# Altium schematic sheet Top.SchDoc
size A
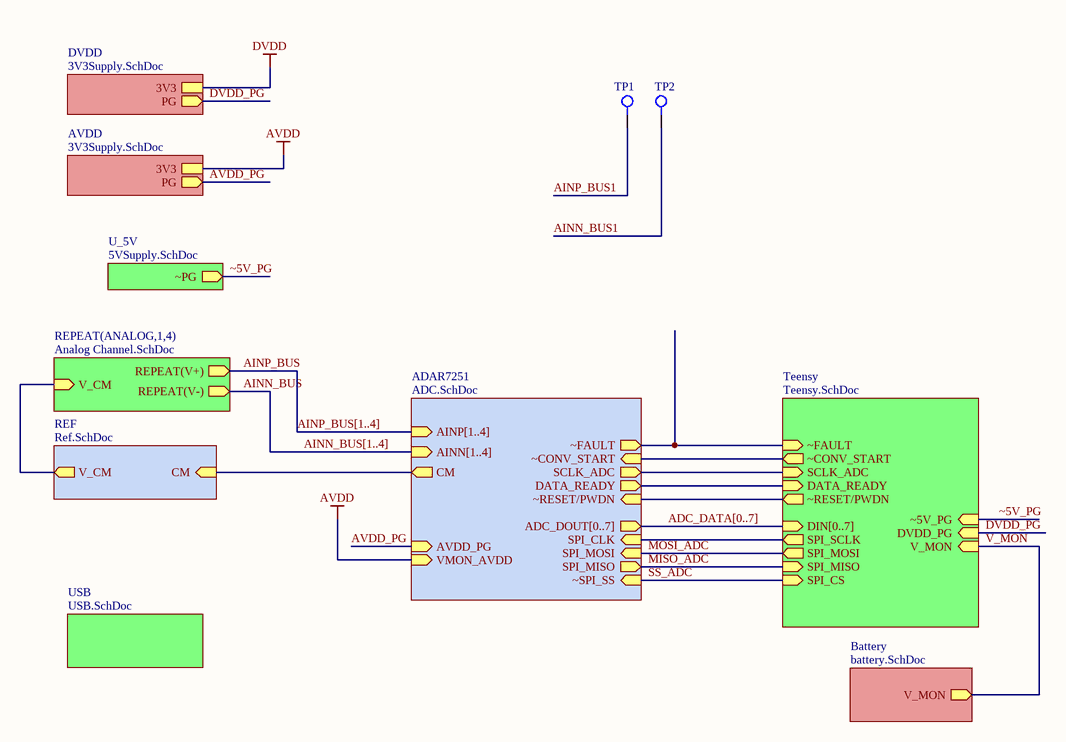
[diagram p0: Top.SchDoc]

## Parts
TP1  TP  [TP_5029]  (value not drawn)
TP2  TP  [TP_5029]  (value not drawn)

## Sub-sheets
ADAR7251 = ADC.SchDoc: AINP[1..4] (in), AINN[1..4] (in), CM (out), ADC_DOUT[0..7] (out), ~CONV_START (in), SCLK_ADC (out), ~SPI_SS (in), SPI_MISO (out), ~FAULT (out), DATA_READY (out), SPI_CLK (in), SPI_MOSI (in), ~RESET/PWDN (in), AVDD_PG (in), VMON_AVDD (in)
AVDD = 3V3Supply.SchDoc: 3V3, PG (out)
Battery = battery.SchDoc: V_MON (out)
DVDD = 3V3Supply.SchDoc: 3V3, PG (out)
REF = Ref.SchDoc: CM (in), V_CM (out)
REPEAT(ANALOG,1,4) = Analog Channel.SchDoc: REPEAT(V+) (out), REPEAT(V-) (out), V_CM (in)
Teensy = Teensy.SchDoc: SPI_MISO (in), ~FAULT (in), SCLK_ADC (in), DVDD_PG (in), ~CONV_START (out), DATA_READY (in), SPI_SCLK (out), SPI_MOSI (out), SPI_CS (in), DIN[0..7] (in), ~RESET/PWDN (out), V_MON (in), ~5V_PG (in)
U_5V = 5VSupply.SchDoc: ~PG (out)
USB = USB.SchDoc: no entries

## Nets
AVDD: sheet ADAR7251/VMON_AVDD, sheet AVDD/3V3
DVDD: sheet DVDD/3V3
AINN_BUS: sheet REPEAT(ANALOG,1,4)/REPEAT(V-)
AINN_BUS1: TP2.1
AINP_BUS: sheet REPEAT(ANALOG,1,4)/REPEAT(V+)
AINP_BUS1: TP1.1
AVDD_PG: sheet ADAR7251/AVDD_PG, sheet AVDD/PG
DVDD_PG: sheet DVDD/PG, sheet Teensy/DVDD_PG
MISO_ADC: sheet ADAR7251/SPI_MISO, sheet Teensy/SPI_MISO
MOSI_ADC: sheet ADAR7251/SPI_MOSI, sheet Teensy/SPI_MOSI
SS_ADC: sheet ADAR7251/~SPI_SS, sheet Teensy/SPI_CS
V_MON: sheet Battery/V_MON, sheet Teensy/V_MON
~5V_PG: sheet U_5V/~PG, sheet Teensy/~5V_PG
(unnamed): sheet REPEAT(ANALOG,1,4)/V_CM, sheet REF/V_CM
(unnamed): sheet ADAR7251/CM, sheet REF/CM
(unnamed): sheet ADAR7251/~CONV_START, sheet Teensy/~CONV_START
(unnamed): sheet ADAR7251/SCLK_ADC, sheet Teensy/SCLK_ADC
(unnamed): sheet ADAR7251/~FAULT, sheet Teensy/~FAULT
(unnamed): sheet ADAR7251/DATA_READY, sheet Teensy/DATA_READY
(unnamed): sheet ADAR7251/SPI_CLK, sheet Teensy/SPI_SCLK
(unnamed): sheet ADAR7251/~RESET/PWDN, sheet Teensy/~RESET/PWDN

## Buses and harness runs
bus ADC_DATA[0..7] = sheet ADAR7251/ADC_DOUT[0..7] = sheet Teensy/DIN[0..7]
bus AINN_BUS[1..4] = sheet ADAR7251/AINN[1..4]
bus AINP_BUS[1..4] = sheet ADAR7251/AINP[1..4]

## Library data of the parts
TP1 TP2 = TP: 5029 SMD 0805 TP; Supplier 1: Digi-Key; Supplier Part Number 1: 36-5029CT-ND